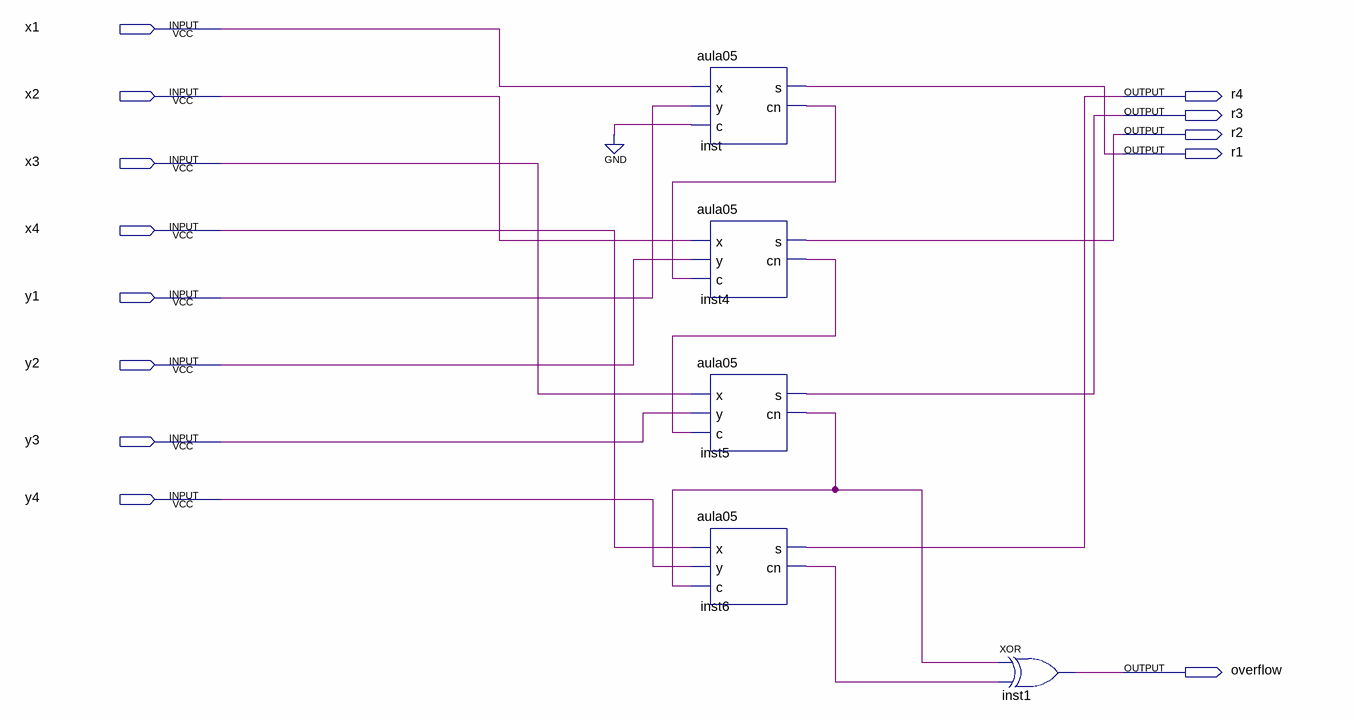
[diagram p0: schematic sheet]
// Quartus schematic aula06.bdf as structural Verilog: 5 symbols, 13 pins
module aula06 (
  input  x1,
  input  x2,
  input  x3,
  input  x4,
  input  y1,
  input  y2,
  input  y3,
  input  y4,
  output r4,
  output r3,
  output r2,
  output r1,
  output overflow
);

  wire inst4_cn, inst5_cn, inst6_cn, inst_cn;

  aula05 inst (.x(x1), .y(y1), .c(1'b0), .s(r1), .cn(inst_cn));
  aula05 inst4 (.x(x2), .y(y2), .c(inst_cn), .s(r2), .cn(inst4_cn));
  aula05 inst5 (.x(x3), .y(y3), .c(inst4_cn), .s(r3), .cn(inst5_cn));
  aula05 inst6 (.x(x4), .y(y4), .c(inst5_cn), .s(r4), .cn(inst6_cn));
  xor inst1 (overflow, inst5_cn, inst6_cn);
endmodule
